# Altium schematic sheet nRF52840-MCU.SchDoc: nRF52840-MCU
size A4; DrawnBy: D.N.Nhuan; Revision: V1.0; SheetNumber: 1; SheetTotal: 2
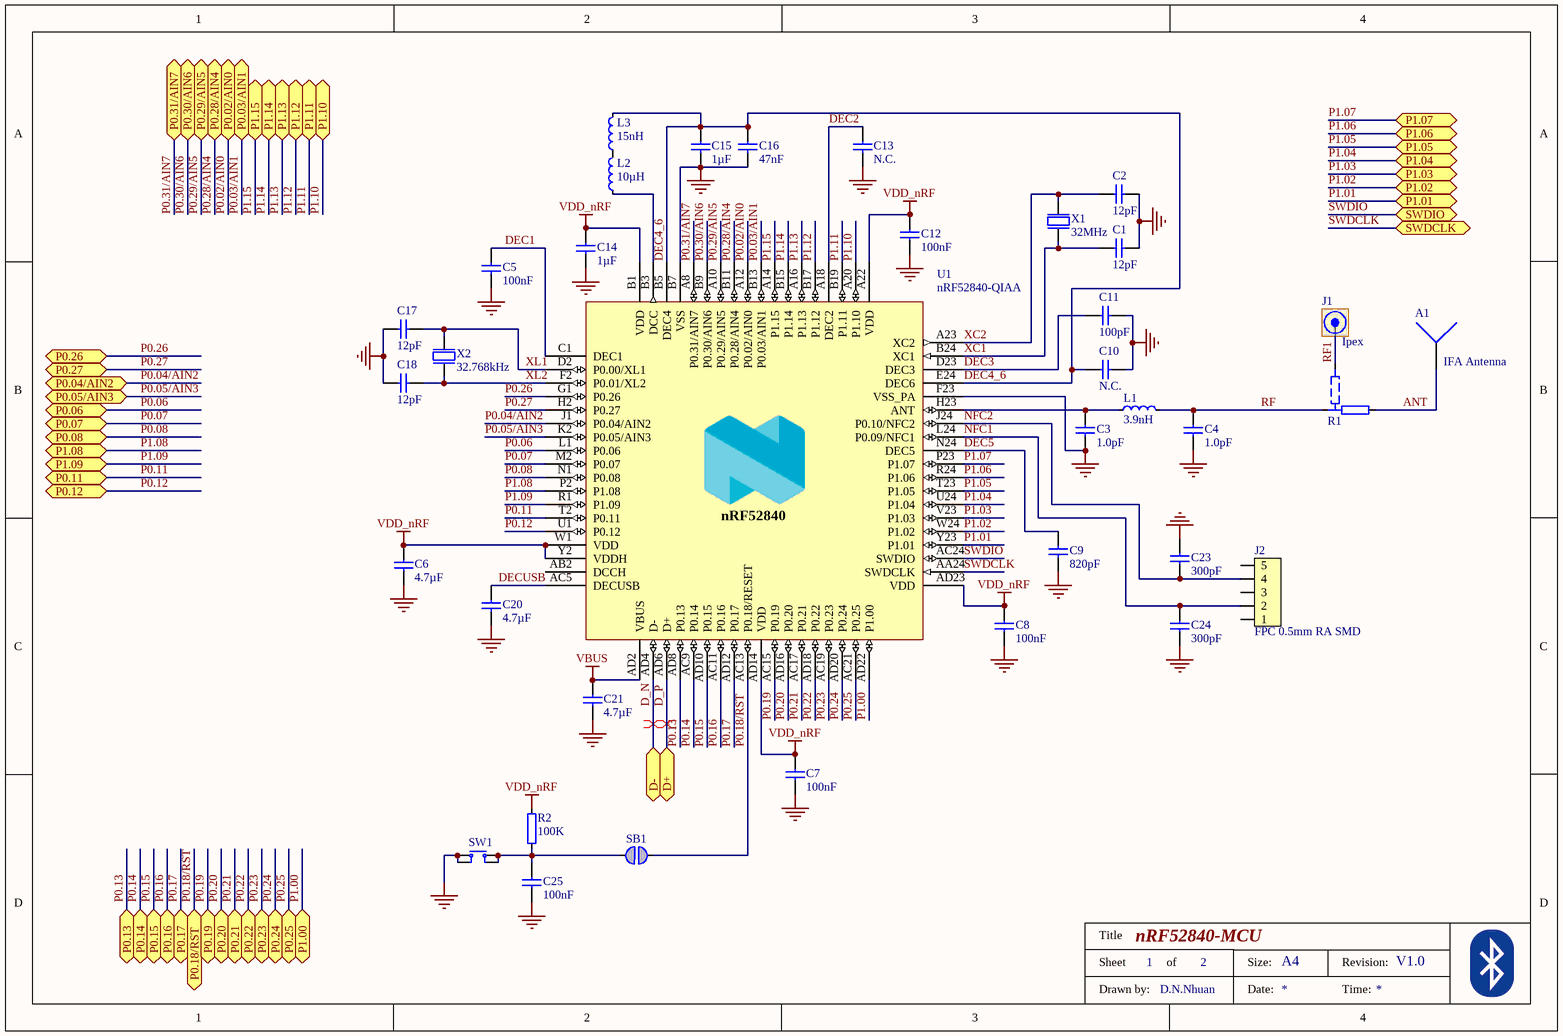
[diagram p0: nRF52840-MCU.SchDoc]

## Parts
A1  IFA Antenna  [IFA_ANTENNA]
C1  12pF  [0402 imperial]
C2  12pF  [0402 imperial]
C3  1.0pF  [0402 imperial]
C4  1.0pF  [0402 imperial]
C5  100nF  [0402 imperial]
C6  4.7µF  [0603_Imperial]
C7  100nF  [0402 imperial]
C8  100nF  [0402 imperial]
C9  820pF  [0402 imperial]
C10  N.C.  [0402 imperial]
C11  100pF  [0402 imperial]
C12  100nF  [0402 imperial]
C13  N.C.  [0402 imperial]
C14  1µF  [0603_Imperial]
C15  1µF  [0603_Imperial]
C16  47nF  [0402 imperial]
C17  12pF  [0402 imperial]
C18  12pF  [0402 imperial]
C20  4.7µF  [0603_Imperial]
C21  4.7µF  [0603_Imperial]
C23  300pF  [0402 imperial]
C24  300pF  [0402 imperial]
C25  100nF  [0402 imperial]
J1  Ipex  [HRS_U.FL-R-SMT]
J2  FPC 0.5mm RA SMD  [FPC_05P-0.5mm-RA-SMD]
L1  3.9nH  [0402 imperial]
L2  10µH  [0603_Imperial]
L3  15nH  [0402 imperial]
R1  Res Selector  [RES_SELECTOR_0402]  (value not drawn)
R2  100K  [0402 imperial]
SB1  Solderbridge  [Solderbridge]  (value not drawn)  (no BOM)
SW1  PB SW  [Switch-PB-6.2x6.3mm-SMD]  (value not drawn)
U1  nRF52840-QIAA  [AQFN50P700X700X85_HS-74N]
X1  32MHz  [XTAL_2016]
X2  32.768kHz  [XTAL_3215]

## Ports
D+, D-, P0.02/AIN0, P0.03/AIN1, P0.04/AIN2, P0.05/AIN3, P0.06, P0.07, P0.08, P0.11, P0.12, P0.13, P0.14, P0.15, P0.16, P0.17, P0.18/RST, P0.19, P0.20, P0.21, P0.22, P0.23, P0.24, P0.25, P0.26, P0.27, P0.28/AIN4, P0.29/AIN5, P0.30/AIN6, P0.31/AIN7, P1.00, P1.01, P1.02, P1.03, P1.04, P1.05, P1.06, P1.07, P1.08, P1.09, P1.10, P1.11, P1.12, P1.13, P1.14, P1.15, SWDCLK, SWDIO

## Nets
GND: A1.2 C1.2 C2.2 C3.1 C4.1 C5.1 C6.1 C7.1 C8.1 C9.1 C10.2 C11.2 C12.1 C13.1 C14.1 C15.1 C16.1 C17.1 C18.1 C20.1 C21.1 C23.2 C24.1 C25.1 J1.1(GND) J1.2(GND) SW1.1(N.O) SW1.3(N.O) U1.74(GND) U1.B7(VSS) U1.F23(VSS_PA) X1.2(GND) X1.4(GND)
VBUS: C21.2 U1.AD2(VBUS)
VDD_nRF: C6.2 C7.2 C8.2 C12.2 C14.2 R2.2 U1.A22(VDD) U1.AD14(VDD) U1.AD23(VDD) U1.B1(VDD) U1.W1(VDD) U1.Y2(VDDH)
ANT: A1.1 R1.2
D_N: U1.AD4(D-) ; port D-
D_P: U1.AD6(D+) ; port D+
DEC1: C5.2 U1.C1(DEC1)
DEC2: C13.2 U1.A18(DEC2)
DEC3: C11.1 U1.D23(DEC3)
DEC4_6: C10.1 C15.2 C16.2 L3.2 U1.B5(DEC4) U1.E24(DEC6)
DEC5: C9.2 U1.N24(DEC5)
DECUSB: C20.2 U1.AC5(DECUSB)
NFC1: C24.2 J2.2 U1.L24(P0.09/NFC1)
NFC2: C23.1 J2.4 U1.J24(P0.10/NFC2)
P0.02/AIN0: U1.A12(P0.02/AIN0) ; port P0.02/AIN0
P0.03/AIN1: U1.B13(P0.03/AIN1) ; port P0.03/AIN1
P0.04/AIN2: U1.J1(P0.04/AIN2) ; port P0.04/AIN2
P0.05/AIN3: U1.K2(P0.05/AIN3) ; port P0.05/AIN3
P0.06: U1.L1(P0.06) ; port P0.06
P0.07: U1.M2(P0.07) ; port P0.07
P0.08: U1.N1(P0.08) ; port P0.08
P0.11: U1.T2(P0.11) ; port P0.11
P0.12: U1.U1(P0.12) ; port P0.12
P0.13: U1.AD8(P0.13) ; port P0.13
P0.14: U1.AC9(P0.14) ; port P0.14
P0.15: U1.AD10(P0.15) ; port P0.15
P0.16: U1.AC11(P0.16) ; port P0.16
P0.17: U1.AD12(P0.17) ; port P0.17
P0.18/RST: SB1.1 U1.AC13(P0.18/RESET) ; port P0.18/RST
P0.19: U1.AC15(P0.19) ; port P0.19
P0.20: U1.AD16(P0.20) ; port P0.20
P0.21: U1.AC17(P0.21) ; port P0.21
P0.22: U1.AD18(P0.22) ; port P0.22
P0.23: U1.AC19(P0.23) ; port P0.23
P0.24: U1.AD20(P0.24) ; port P0.24
P0.25: U1.AC21(P0.25) ; port P0.25
P0.26: U1.G1(P0.26) ; port P0.26
P0.27: U1.H2(P0.27) ; port P0.27
P0.28/AIN4: U1.B11(P0.28/AIN4) ; port P0.28/AIN4
P0.29/AIN5: U1.A10(P0.29/AIN5) ; port P0.29/AIN5
P0.30/AIN6: U1.B9(P0.30/AIN6) ; port P0.30/AIN6
P0.31/AIN7: U1.A8(P0.31/AIN7) ; port P0.31/AIN7
P1.00: U1.AD22(P1.00) ; port P1.00
P1.01: U1.Y23(P1.01) ; port P1.01
P1.02: U1.W24(P1.02) ; port P1.02
P1.03: U1.V23(P1.03) ; port P1.03
P1.04: U1.U24(P1.04) ; port P1.04
P1.05: U1.T23(P1.05) ; port P1.05
P1.06: U1.R24(P1.06) ; port P1.06
P1.07: U1.P23(P1.07) ; port P1.07
P1.08: U1.P2(P1.08) ; port P1.08
P1.09: U1.R1(P1.09) ; port P1.09
P1.10: U1.A20(P1.10) ; port P1.10
P1.11: U1.B19(P1.11) ; port P1.11
P1.12: U1.B17(P1.12) ; port P1.12
P1.13: U1.A16(P1.13) ; port P1.13
P1.14: U1.B15(P1.14) ; port P1.14
P1.15: U1.A14(P1.15) ; port P1.15
RF: C4.2 L1.2 R1.1
RF1: J1.3(SIG) R1.3
SWDCLK: U1.AA24(SWDCLK) ; port SWDCLK
SWDIO: U1.AC24(SWDIO) ; port SWDIO
XC1: C1.1 U1.B24(XC1) X1.1(inp)
XC2: C2.1 U1.A23(XC2) X1.3(out)
XL1: C17.2 U1.D2(P0.00/XL1) X2.2(out)
XL2: C18.2 U1.F2(P0.01/XL2) X2.1(inp)
NetC3_2: C3.2 L1.1 U1.H23(ANT)
NetC25_2: C25.2 R2.1 SB1.2 SW1.2(COM) SW1.4(COM)
NetL2_1: L2.1 U1.B3(DCC)
NetL2_2: L2.2 L3.1

Not connected (* = marked no-connect by the designer): J2 1 3 5; U1 AB2(DCCH)

## Layout directives
differential pair: D_N, D_P

## Notes on the sheet
- Title
- Sheet
- of
- Size:
- A4
- Revision:
- Drawn by:
- Date:
- Time:
- (in symbol nRF52840_QIAA) nRF52840

## Library data of the parts
A1 = IFA Antenna: Texas Instrument
C1-C18 C20 C21 C23-C25 = Capacitor: common library; Tolerance: ±5%; Link of Supplier: *; Manufacturer: *; Manufacturer Part Number: *; Voltage Rating: *
  C1 C2 C17 C18: Value: 12pF
  C3 C4: Value: 1.0pF
  C5 C7 C8 C12 C25: Value: 100nF
  C6 C20 C21: Value: 4.7µF
  C9: Value: 820pF
  C10 C13: Value: N.C.
  C11: Value: 100pF
  C14 C15: Value: 1µF
  C16: Value: 47nF
  C23 C24: Value: 300pF
J1 = IPEX connector: Hirose; MP: U.FL-R-SMT_01_; Note: Ipex; MF: Hirose
J2 = FPC_05P-0.5mm-RA-SMD: 0.5mm FPC, 5P,Right Angle SMT,Double Contact,H=1.2mm,White, Tin plated; Manufacturer: W-CON; Manufacturer Part Number: 5141-05RZDNWR01; 2nd source part number: WM9836CT-ND; Part number IPS: 00000007792; Artikkelnr Noca: 55010020; Artikkelnr Simpro: N.A.; Part Number: FPC_05P-0.5mm-RA-SMD; Datasheet: \\hizz\pro\app9717\Datasheet\connectores\W-CON\5141-XXRZDNXX0X.pdf; Footprint Doc: FPC_05P-0.5mm-RA-SMD; LatestRevisionDate: 2016-04-21; Pin Count: 7; Publisher: Nordic Semiconductor; Published: 2015-06-22; Value: FPC 0.5mm RA SMD; Note: *; Supplier: Cabcon; Supplier part number: 5141-05RZDNWR01; 2nd source Supplier: Digi-Key
L1-L3 = Inductor: common library; Supplier: *; Link of Supplier: *; Maximum Current: *; Footprint: 0402
  L1: Value: 3.9nH
  L2: Value: 10µH
  L3: Value: 15nH
R1 = Res_Selector: Value: 0R; Name: Res Selector
R2 = Resistor: common library; Tolerance: ±5%; Value: 100K; Link of Supplier: *; Power Rating: *
SB1 = Solderbridge: Artikkelnr Noca: N.A.; Part Number: Solderbridge; Manufacturer: *; Manufacturer Part Number: *; Datasheet: *; LatestRevisionDate: 2009-12-14; Pin Count: 2; Publisher: Nordic Semiconductor; Published: 2009-12-14; Value: Solderbridge; Note: *; Supplier: *; Supplier part number: *; 2nd source Supplier: *; 2nd source part number: *; Footprint Doc: Solderbridge; Artikkelnr Simpro: N.A.
SW1 = Push-Button: 4-pin; Manufacturer: *; Manufacturer Part Number: *; Pin Count: 4; Value: PB SW; Note: *; Part Number: *
U1 = nRF52840_QIAA: Multi-protocol Bluetooth Low Energy, IEEE 802.15.4, ANT and 2.4GHz proprietary system-on-chip; Part Number: nRF52840-QIAAC0; Manufacturer: Nordic Semiconductor; Artikkelnr Noca: N.A.; Manufacturer Part Number: nRF52840-QIAAC0; LatestRevisionDate: 2017-12-06; Pin Count: 73; Publisher: Nordic Semiconductor; Published: 2017-08-21; Value: nRF52840-QIAA; Note: *; Supplier: Nordic Semiconductor; Supplier part number: nRF52840-QIAAC0; 2nd source Supplier: *; 2nd source part number: *; Footprint Doc: AQFN-73; Artikkelnr Simpro: N.A.; Part number IPS: N.A.; ComponentLink1URL: *; ComponentLink1Description: Datasheet; ComponentLink2URL: *; ComponentLink2Description: Supplier link; HelpURL: *
X1 = XTAL: 4-pin; Value: 32MHz
X2 = XTAL_1: 2-pin; Value: 32.768kHz